# EasyEDA schematic SCH_POC-StartStopInterrupt_2022-12-13.json
TITLE: POC_StartStopInterrupt; REV: 1.0; Date: 2022-12-13; Sheet: 1/1; Drawn By: milanvannieuwenhuyze; Company: HoGent
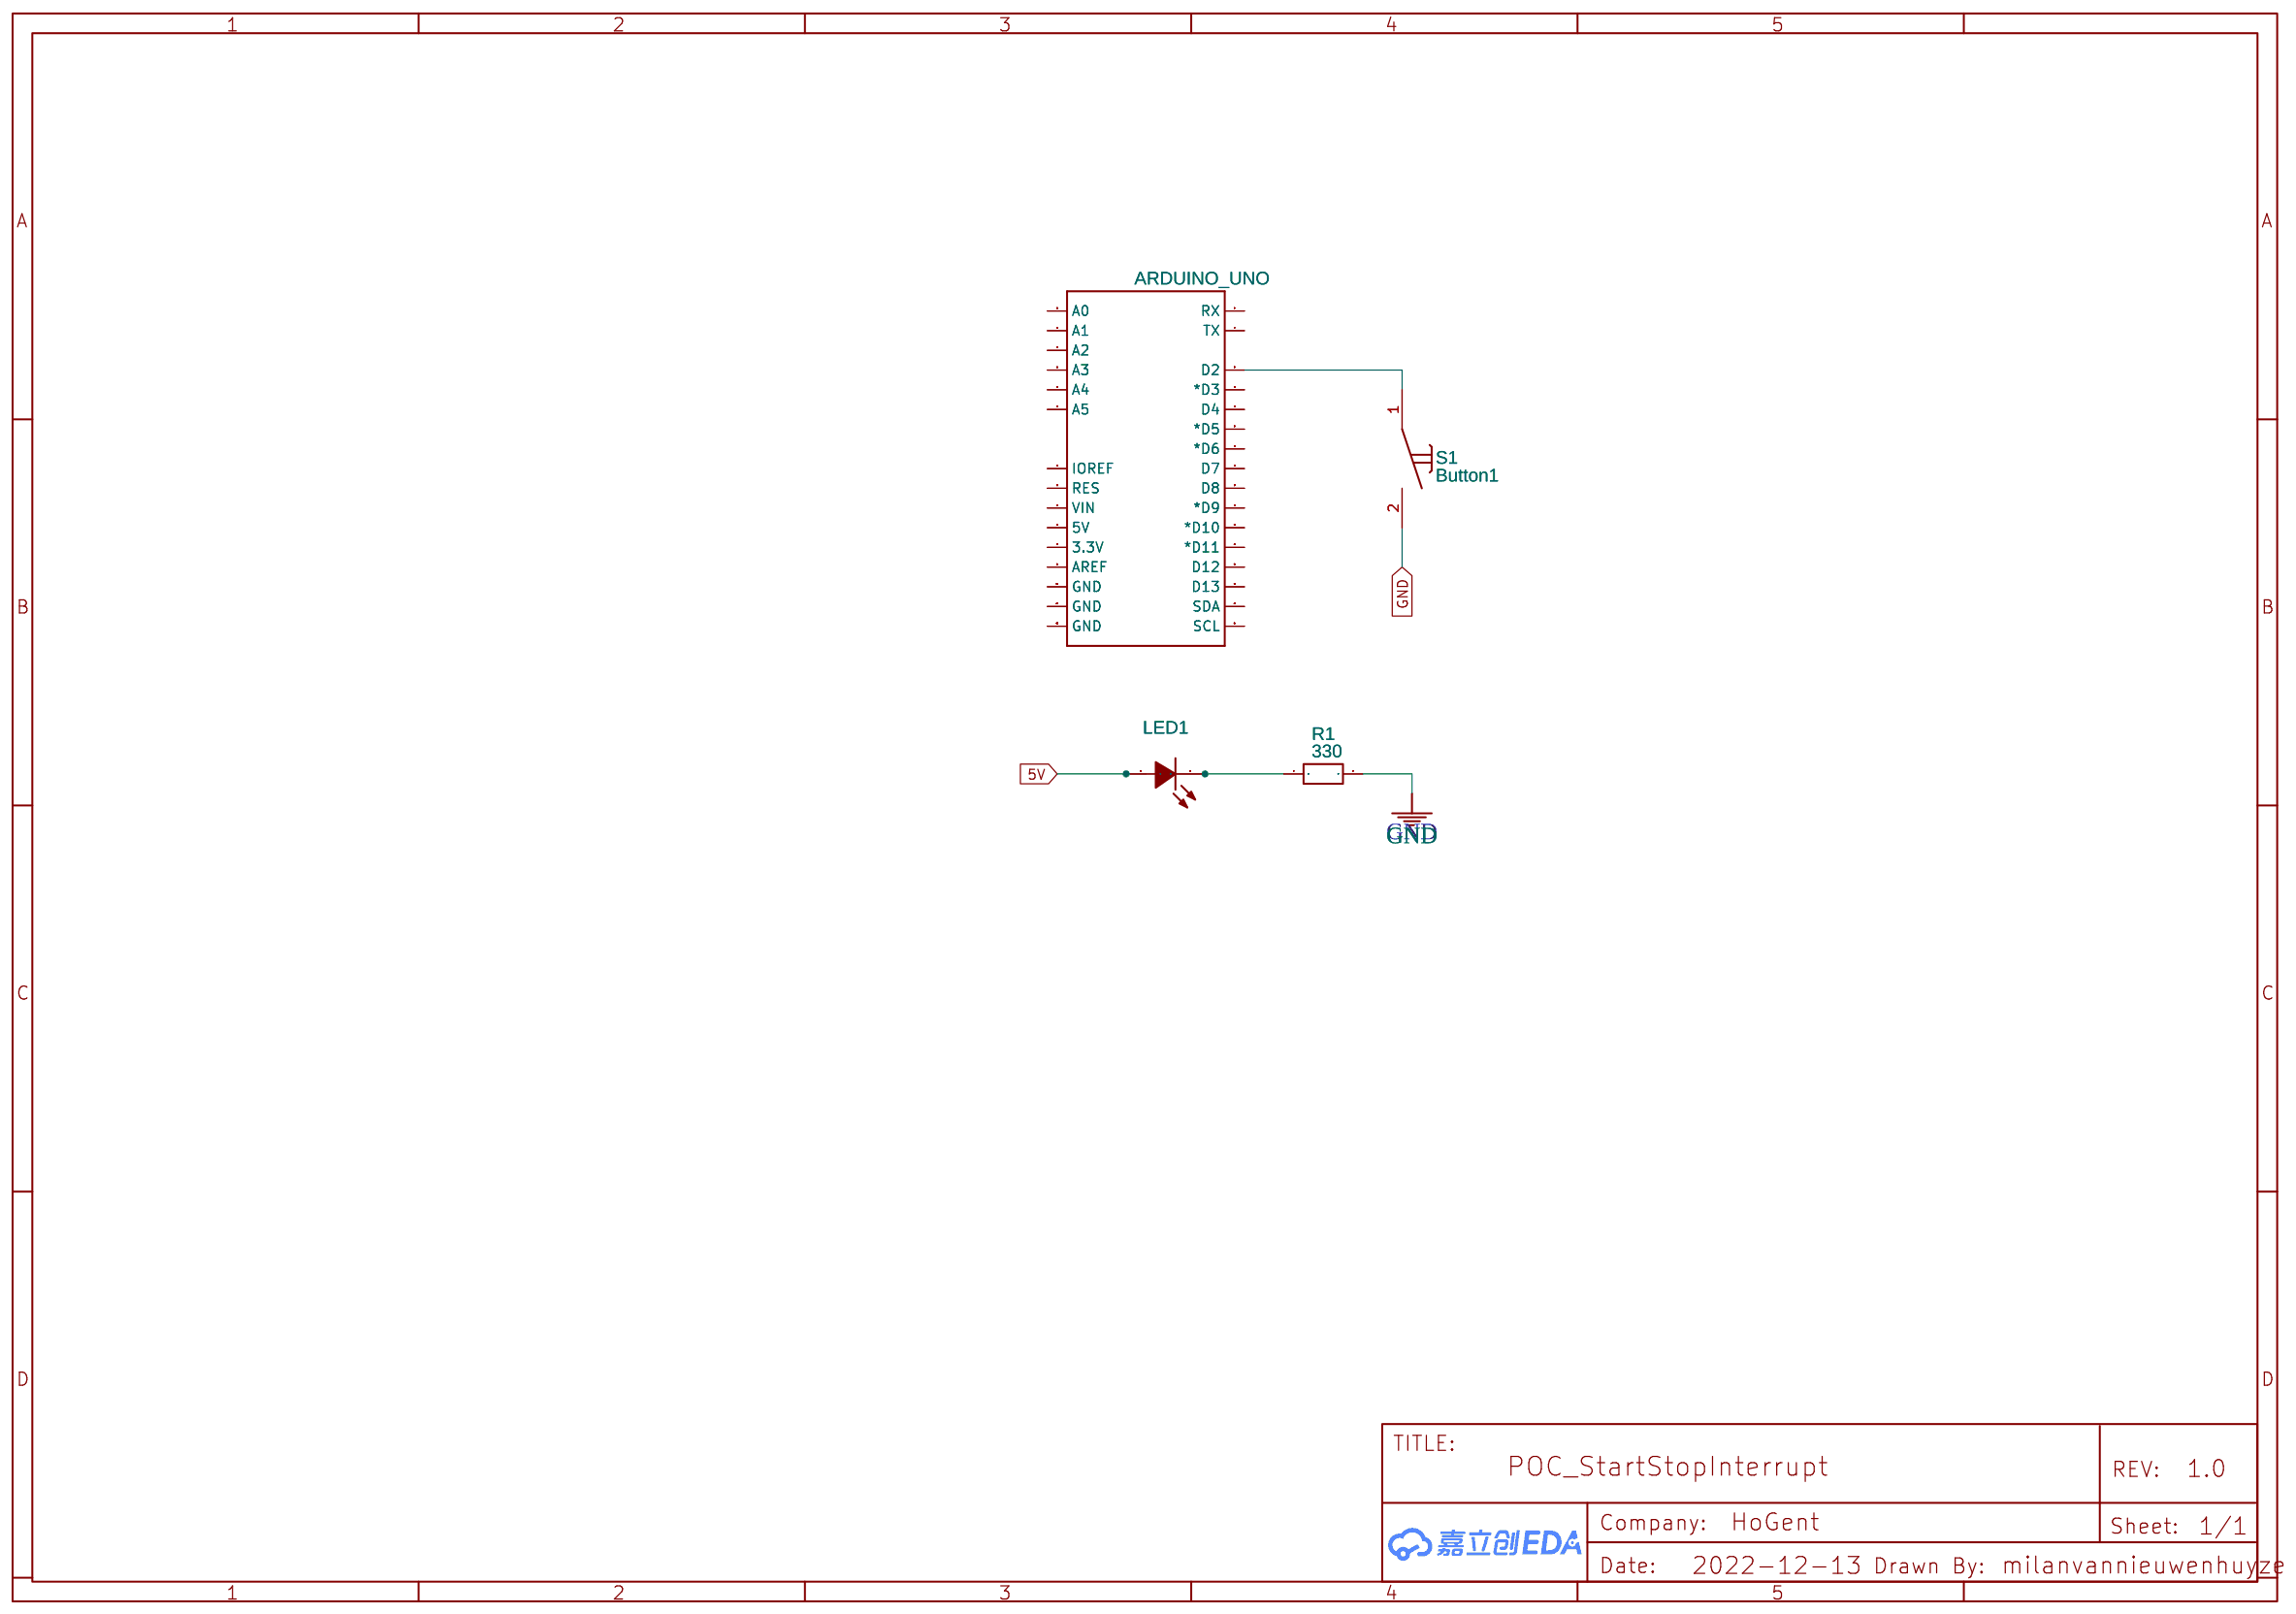
[diagram p0: schematic sheet]

## Parts
LED1  BL-HUE35A-AV-TRE  [LED0805-RD_BRTLED_BL-HUE35A-AV-TRE]
R1  330  [R0603]
S1  Button1  [3X5 PUSHBUTTON]
U1  ARDUINO_UNO  [UNO_R3_SHIELD_NOLABELS]

## Library data of the parts
LED1 = BL-HUE35A-AV-TRE: Supplier: LCSC; Manufacturer: BrtLed; Contributor: LCSC; Supplier Part: C138549; JLCPCB Part Class: Extended Part
R1 = R_0603_EU: Contributor: LCEDA_Lib
S1 = Button1: sourceId: K60iAuM3l
U1 = ARDUINO_R3_SHIELD: Contributor: SparkFun

## Nets
5V: LED1.2(A)
GND: R1.2 S1.2
Net-(LED1-1): LED1.1(K) R1.1
Net-(S1-1): S1.1 U1.D2

Not connected (* = marked no-connect by the designer): U1 3.3V 5V A0 A1 A2 A3 A4 A5 AREF D3(*D3) D4 D5(*D5) D6(*D6) D7 D8 D9(*D9) D10(*D10) D11(*D11) D12 D13 GND@0(GND) GND@1(GND) GND@2(GND) IOREF RES RX SCL SDA TX VIN

## Notes on the sheet
- GND
